# Altium schematic sheet LAN8870_PINOUT.SchDoc
size C; SheetNumber: 3; SheetTotal: 5
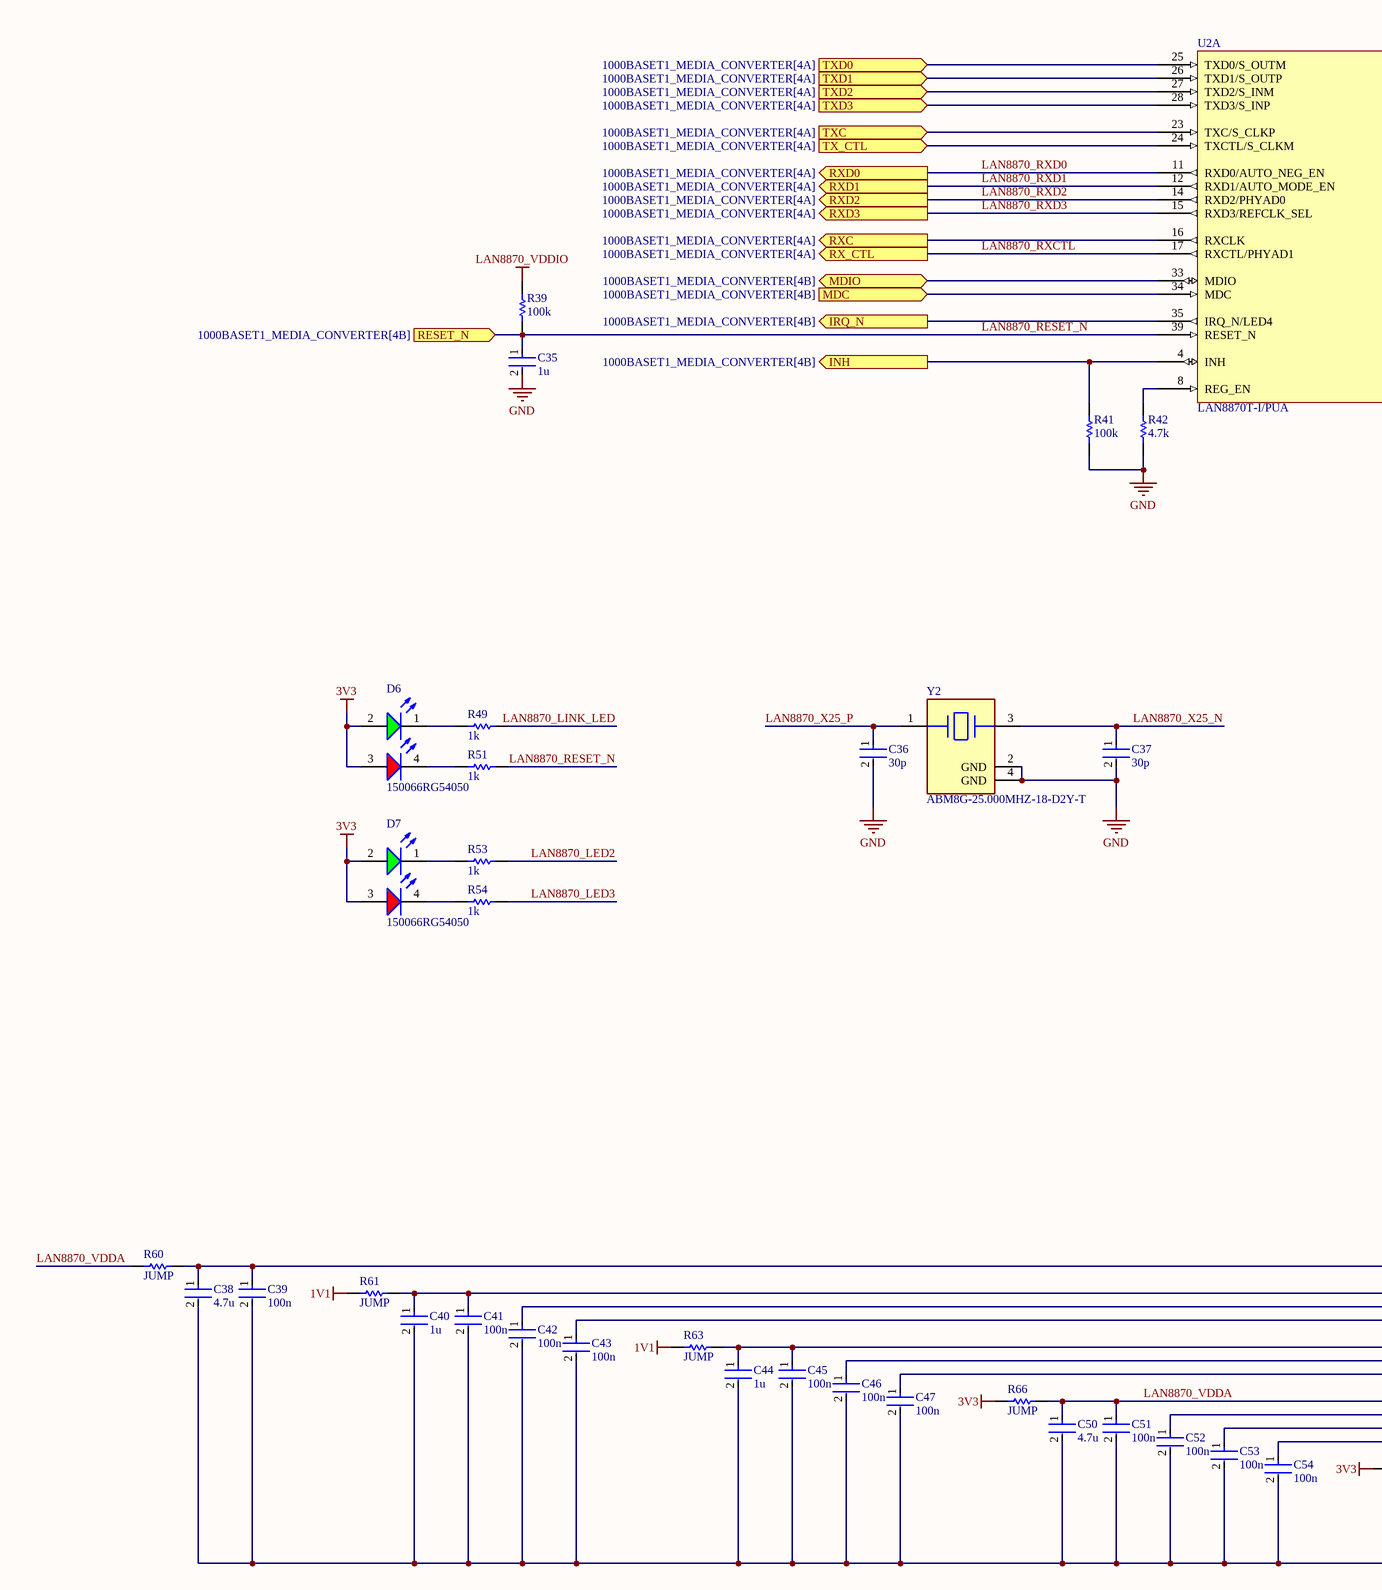
[diagram p0: LAN8870_PINOUT.SchDoc, left]
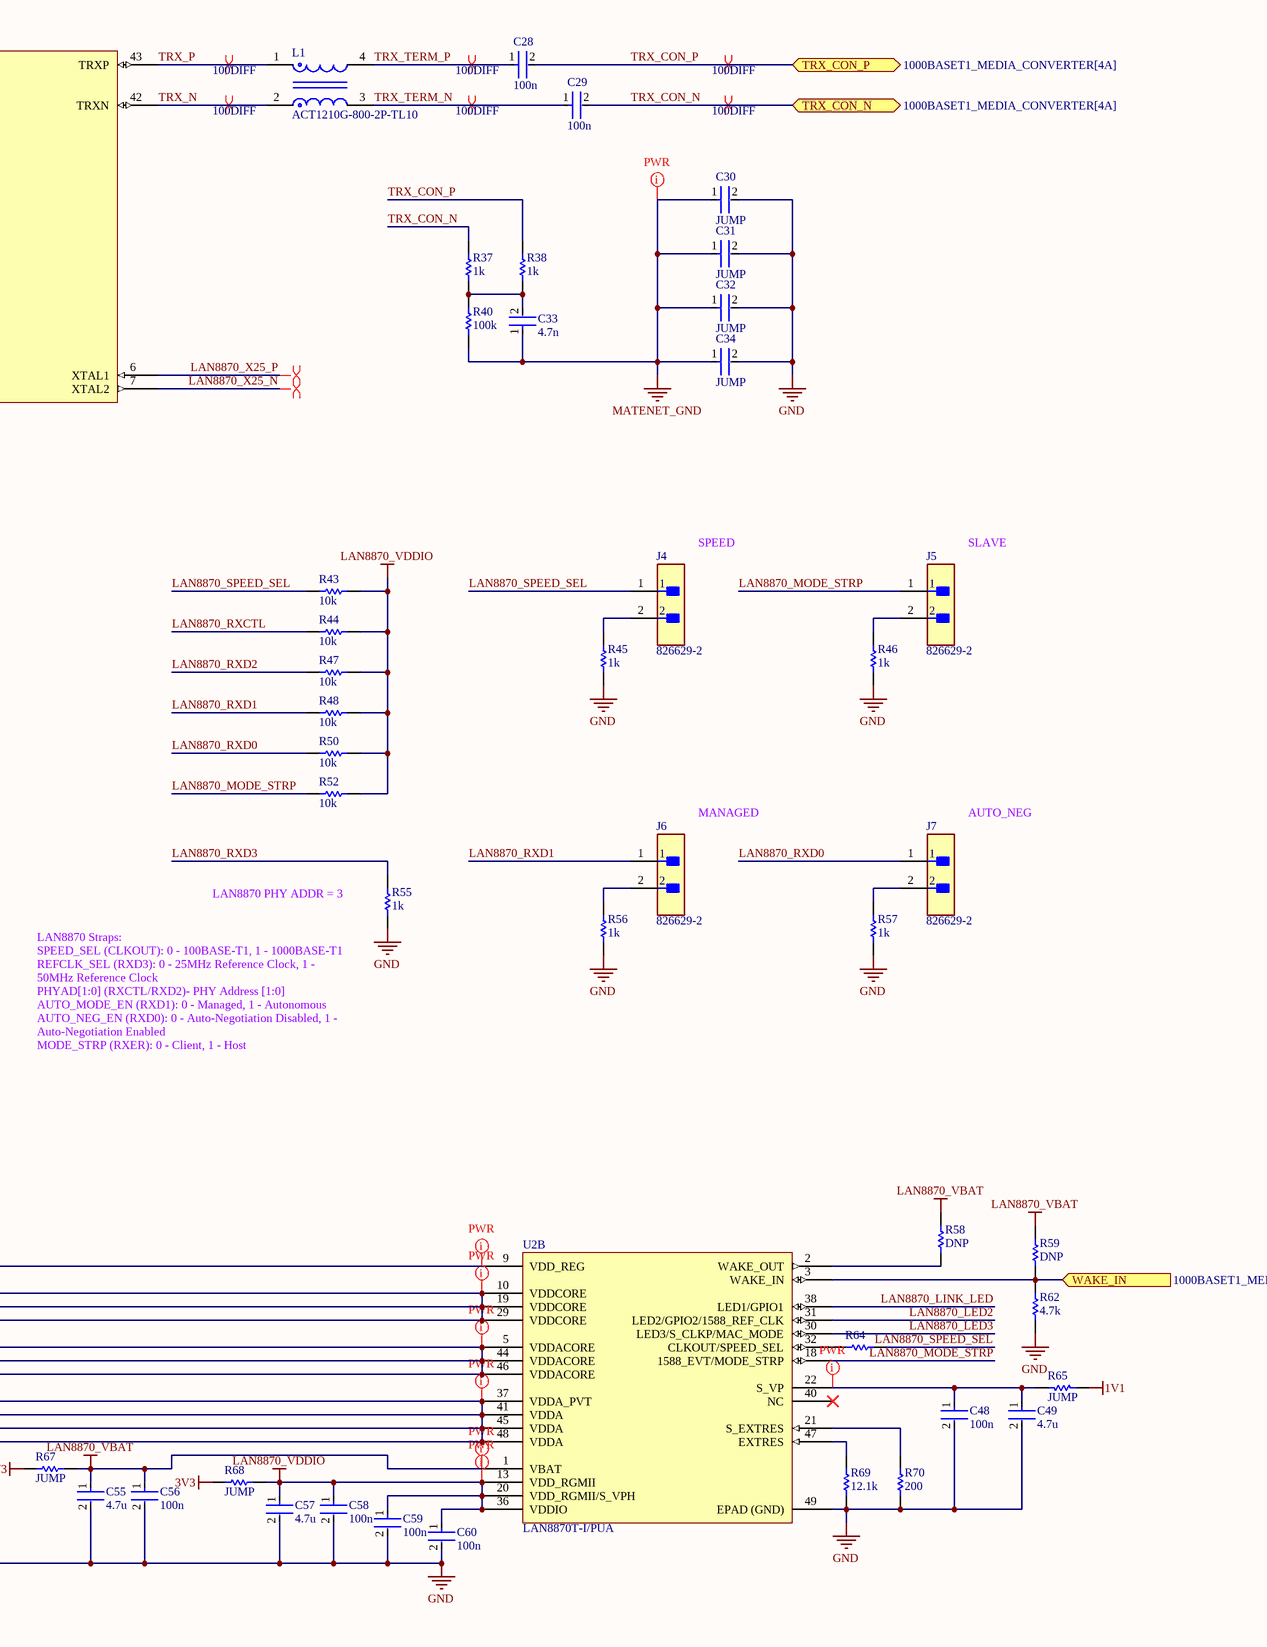
[diagram p1: LAN8870_PINOUT.SchDoc, right]

## Parts
C28  100n  [FP-0402-L_1_0_0_05-W_0_5-IPC_A]
C29  100n  [FP-0402-L_1_0_0_05-W_0_5-IPC_A]
C30  JUMP  [FP-0402-L_1_0_0_05-W_0_5-IPC_A]
C31  JUMP  [FP-0402-L_1_0_0_05-W_0_5-IPC_A]
C32  JUMP  [FP-0402-L_1_0_0_05-W_0_5-IPC_A]
C33  4.7n  [FP-0402-L_1_0_0_05-W_0_5-IPC_A]
C34  JUMP  [FP-0402-L_1_0_0_05-W_0_5-IPC_A]
C35  1u  [FP-0402-L_1_0_0_05-W_0_5-IPC_A]
C36  30p  [FP-0402-L_1_0_0_05-W_0_5-IPC_A]
C37  30p  [FP-0402-L_1_0_0_05-W_0_5-IPC_A]
C38  4.7u  [FP-0402-L_1_0_0_05-W_0_5-IPC_A]
C39  100n  [FP-0402-L_1_0_0_05-W_0_5-IPC_A]
C40  1u  [FP-0402-L_1_0_0_05-W_0_5-IPC_A]
C41  100n  [FP-0402-L_1_0_0_05-W_0_5-IPC_A]
C42  100n  [FP-0402-L_1_0_0_05-W_0_5-IPC_A]
C43  100n  [FP-0402-L_1_0_0_05-W_0_5-IPC_A]
C44  1u  [FP-0402-L_1_0_0_05-W_0_5-IPC_A]
C45  100n  [FP-0402-L_1_0_0_05-W_0_5-IPC_A]
C46  100n  [FP-0402-L_1_0_0_05-W_0_5-IPC_A]
C47  100n  [FP-0402-L_1_0_0_05-W_0_5-IPC_A]
C48  100n  [FP-0402-L_1_0_0_05-W_0_5-IPC_A]
C49  4.7u  [FP-0402-L_1_0_0_05-W_0_5-IPC_A]
C50  4.7u  [FP-0402-L_1_0_0_05-W_0_5-IPC_A]
C51  100n  [FP-0402-L_1_0_0_05-W_0_5-IPC_A]
C52  100n  [FP-0402-L_1_0_0_05-W_0_5-IPC_A]
C53  100n  [FP-0402-L_1_0_0_05-W_0_5-IPC_A]
C54  100n  [FP-0402-L_1_0_0_05-W_0_5-IPC_A]
C55  4.7u  [FP-0402-L_1_0_0_05-W_0_5-IPC_A]
C56  100n  [FP-0402-L_1_0_0_05-W_0_5-IPC_A]
C57  4.7u  [FP-0402-L_1_0_0_05-W_0_5-IPC_A]
C58  100n  [FP-0402-L_1_0_0_05-W_0_5-IPC_A]
C59  100n  [FP-0402-L_1_0_0_05-W_0_5-IPC_A]
C60  100n  [FP-0402-L_1_0_0_05-W_0_5-IPC_A]
D6  150066RG54050  [WL-SBCD_0606]
D7  150066RG54050  [WL-SBCD_0606]
J4  826629-2  [FP-826629-2-MFG]
J5  826629-2  [FP-826629-2-MFG]
J6  826629-2  [FP-826629-2-MFG]
J7  826629-2  [FP-826629-2-MFG]
L1  ACT1210G-800-2P-TL10  [FP-ACT1210G-800-2P-TL10-MFG]
R37  1k  [R0603B]
R38  1k  [R0603B]
R39  100k  [R0603B]
R40  100k  [R0603B]
R41  100k  [R0603B]
R42  4.7k  [R0603B]
R43  10k  [R0603B]
R44  10k  [R0603B]
R45  1k  [R0603B]
R46  1k  [R0603B]
R47  10k  [R0603B]
R48  10k  [R0603B]
R49  1k  [R0603B]
R50  10k  [R0603B]
R51  1k  [R0603B]
R52  10k  [R0603B]
R53  1k  [R0603B]
R54  1k  [R0603B]
R55  1k  [R0603B]
R56  1k  [R0603B]
R57  1k  [R0603B]
R58  DNP  [R0603B]
R59  DNP  [R0603B]
R60  JUMP  [R0603B]
R61  JUMP  [R0603B]
R62  4.7k  [R0603B]
R63  JUMP  [R0603B]
R64  0402 JUMPER  [RESC1005X40X25ML05T05]  (value not drawn)
R65  JUMP  [R0603B]
R66  JUMP  [R0603B]
R67  JUMP  [R0603B]
R68  JUMP  [R0603B]
R69  12.1k  [R0603B]
R70  200  [R0603B]
U2  LAN8870T-I/PUA  [QFN50P700X700X100_HS-49N]  (parts A,B of 2)
Y2  ABM8G-25.000MHZ-18-D2Y-T  [FP-ABM8G-MFG]

## Ports
INH (out, see 1000BASET1_MEDIA_CONVERTER[4B]), IRQ_N (out, see 1000BASET1_MEDIA_CONVERTER[4B]), MDC (in, see 1000BASET1_MEDIA_CONVERTER[4B]), MDIO (bidir, see 1000BASET1_MEDIA_CONVERTER[4B]), RESET_N (in, see 1000BASET1_MEDIA_CONVERTER[4B]), RX_CTL (out, see 1000BASET1_MEDIA_CONVERTER[4A]), RXC (out, see 1000BASET1_MEDIA_CONVERTER[4A]), RXD0 (out, see 1000BASET1_MEDIA_CONVERTER[4A]), RXD1 (out, see 1000BASET1_MEDIA_CONVERTER[4A]), RXD2 (out, see 1000BASET1_MEDIA_CONVERTER[4A]), RXD3 (out, see 1000BASET1_MEDIA_CONVERTER[4A]), TRX_CON_N (bidir, see 1000BASET1_MEDIA_CONVERTER[4A]), TRX_CON_P (bidir, see 1000BASET1_MEDIA_CONVERTER[4A]), TX_CTL (in, see 1000BASET1_MEDIA_CONVERTER[4A]), TXC (in, see 1000BASET1_MEDIA_CONVERTER[4A]), TXD0 (in, see 1000BASET1_MEDIA_CONVERTER[4A]), TXD1 (in, see 1000BASET1_MEDIA_CONVERTER[4A]), TXD2 (in, see 1000BASET1_MEDIA_CONVERTER[4A]), TXD3 (in, see 1000BASET1_MEDIA_CONVERTER[4A]), WAKE_IN (in, see 1000BASET1_MEDIA_CONVERTER[4B])

## Nets
1V1: R61.1 R63.1 R65.1
3V3: D6.2(A) D6.3(A) D7.2(A) D7.3(A) R66.1 R67.1 R68.1
GND: C30.2 C31.2 C32.2 C34.2 C35.2 C36.2 C37.2 C38.2 C39.2 C40.2 C41.2 C42.2 C43.2 C44.2 C45.2 C46.2 C47.2 C48.2 C49.2 C50.2 C51.2 C52.2 C53.2 C54.2 C55.2 C56.2 C57.2 C58.2 C59.2 C60.2 R41.2 R42.2 R45.1 R46.1 R55.1 R56.1 R57.1 R62.2 R69.2 R70.2 U2.49(EPAD_(GND)) Y2.2(GND) Y2.4(GND)
LAN8870_VBAT: C55.1 C56.1 R58.1 R59.1 R67.2 U2.1(VBAT)
LAN8870_VDDIO: C57.1 C58.1 C59.1 C60.1 R39.1 R43.2 R44.1 R47.2 R48.2 R50.2 R52.2 R68.2 U2.13(VDD_RGMII) U2.20(VDD_RGMII/S_VPH) U2.36(VDDIO)
MATENET_GND: C30.1 C31.1 C32.1 C33.1 C34.1 R40.2
INH: R41.1 U2.4(INH) ; port INH
IRQ_N: U2.35(IRQ_N/LED4) ; port IRQ_N
LAN8870_LED2: R53.2 U2.31(LED2/GPIO2/1588_REF_CLK)
LAN8870_LED3: R54.2 U2.30(LED3/S_CLKP/MAC_MODE)
LAN8870_LINK_LED: R49.2 U2.38(LED1/GPIO1)
LAN8870_MODE_STRP: J5.1 R52.1 U2.18(1588_EVT/MODE_STRP)
LAN8870_RESET_N: C35.1 R39.2 R51.2 U2.39(RESET_N) ; port RESET_N
LAN8870_RXCTL: R44.2 U2.17(RXCTL/PHYAD1) ; port RX_CTL
LAN8870_RXD0: J7.1 R50.1 U2.11(RXD0/AUTO_NEG_EN) ; port RXD0
LAN8870_RXD1: J6.1 R48.1 U2.12(RXD1/AUTO_MODE_EN) ; port RXD1
LAN8870_RXD2: R47.1 U2.14(RXD2/PHYAD0) ; port RXD2
LAN8870_RXD3: R55.2 U2.15(RXD3/REFCLK_SEL) ; port RXD3
LAN8870_SPEED_SEL: J4.1 R43.1 R64.2
LAN8870_VDDA: C50.1 C51.1 C52.1 C53.1 C54.1 R60.1 R66.2 U2.37(VDDA_PVT) U2.41(VDDA) U2.45(VDDA) U2.48(VDDA)
LAN8870_X25_N: C37.1 U2.7(XTAL2) Y2.3
LAN8870_X25_P: C36.1 U2.6(XTAL1) Y2.1
MDC: U2.34(MDC) ; port MDC
MDIO: U2.33(MDIO) ; port MDIO
RXC: U2.16(RXCLK) ; port RXC
TRX_CON_N: C29.2 R37.2 ; port TRX_CON_N
TRX_CON_P: C28.2 R38.2 ; port TRX_CON_P
TRX_N: L1.2 U2.42(TRXN)
TRX_P: L1.1 U2.43(TRXP)
TRX_TERM_N: C29.1 L1.3
TRX_TERM_P: C28.1 L1.4
TX_CTL: U2.24(TXCTL/S_CLKM) ; port TX_CTL
TXC: U2.23(TXC/S_CLKP) ; port TXC
TXD0: U2.25(TXD0/S_OUTM) ; port TXD0
TXD1: U2.26(TXD1/S_OUTP) ; port TXD1
TXD2: U2.27(TXD2/S_INM) ; port TXD2
TXD3: U2.28(TXD3/S_INP) ; port TXD3
WAKE_IN: R59.2 R62.1 U2.3(WAKE_IN) ; port WAKE_IN
NetC33_2: C33.2 R37.1 R38.1 R40.1
NetC38_1: C38.1 C39.1 R60.2 U2.9(VDD_REG)
NetC40_1: C40.1 C41.1 C42.1 C43.1 R61.2 U2.10(VDDCORE) U2.19(VDDCORE) U2.29(VDDCORE)
NetC44_1: C44.1 C45.1 C46.1 C47.1 R63.2 U2.5(VDDACORE) U2.44(VDDACORE) U2.46(VDDACORE)
NetC48_1: C48.1 C49.1 R65.2 U2.22(S_VP)
NetD6_1: D6.1(K) R49.1
NetD6_4: D6.4(K) R51.1
NetD7_1: D7.1(K) R53.1
NetD7_4: D7.4(K) R54.1
NetJ4_2: J4.2 R45.2
NetJ5_2: J5.2 R46.2
NetJ6_2: J6.2 R56.2
NetJ7_2: J7.2 R57.2
NetR42_1: R42.1 U2.8(REG_EN)
NetR58_2: R58.2 U2.2(WAKE_OUT)
NetR64_1: R64.1 U2.32(CLKOUT/SPEED_SEL)
NetR69_1: R69.1 U2.47(EXTRES)
NetR70_1: R70.1 U2.21(S_EXTRES)

Not connected (* = marked no-connect by the designer): U2 40(NC)*

## Layout directives
differential pair; differential pair class 100DIFF: TRX_CON_N, TRX_CON_P, TRX_N, TRX_P, TRX_TERM_N, TRX_TERM_P
differential pair: LAN8870_X25_N, LAN8870_X25_P
net class PWR: LAN8870_VBAT, LAN8870_VDDA, LAN8870_VDDIO, MATENET_GND, NetC38_1, NetC40_1, NetC44_1, NetC48_1

## Notes on the sheet
- SPEED
- SLAVE
- MANAGED
- AUTO_NEG
- LAN8870 PHY ADDR = 3
- (near R55) LAN8870 Straps:
  SPEED_SEL (CLKOUT): 0 - 100BASE-T1, 1 - 1000BASE-T1
  REFCLK_SEL (RXD3): 0 - 25MHz Reference Clock, 1 - 50MHz Reference Clock
  PHYAD[1:0] (RXCTL/RXD2)- PHY Address [1:0]
  AUTO_MODE_EN (RXD1): 0 - Managed, 1 - Autonomous
  AUTO_NEG_EN (RXD0): 0 - Auto-Negotiation Disabled, 1 - Auto-Negotiation Enabled
  MODE_STRP (RXER): 0 - Client, 1 - Host

## Library data of the parts
C28-C60 = CMP-001-00058-1: LARGE PADS, 0402 CAP, CHANGE COMMENT TO MATCH REAL P/N; Capacitor Type: Ceramic; Min Operating Temperature: -55°C; Mounting Technology: Surface Mount; Pins: 2; Case/Package: 0402; RoHS Compliant: Yes; Max Operating Temperature: 85°C
D6 D7 = CMP-004-00040-2: Led, Red/Grn, 180Mcd/230Mcd, 624Nm/525Nm Rohs Compliant: Yes; Source: rgled.SchLib; Component Type: Standard; Design Item ID: CMP-004-00034-2; Pins: 4
J4-J7 = CMP-05178-000003-1: CONN HEADER VERT 2POS 2.54MM; RoHS Compliant: Yes
L1 = CMP-08256-000023-1: CMC 80UH 70MA 2LN 3.8KOHM SMD
R37 R38 R42-R59 R62 R69 R70 = CMP-009-00002-14: Resistor; Value: 100k
R39-R41 = CMP-009-00002-14: Resistor; Value: 100k
R60 R61 R63 R65-R68 = CMP-009-00002-14: Resistor; Value: 0
R64 = CMP-009-00118-2: READ THE NAME; Pins: 2; Component Type: Standard; Design Item ID: CMP-009-00206-2; Source: 0402jump.SchLib
U2 = CMP-015-00023-4: 100/1000BASE-T1 Rgmii/sgmii Phy; Case/Package: VQFN; Pins: 48
Y2 = CMP-2000-05733-3: Crystal 25MHz ±20ppm (Tol) ±30ppm (Stability) 18pF FUND 60Ω 4-Pin SMD T/R; Series Resistance: 60R; Length: 3.2mm; Depth: 2.5mm; Packaging: Tape and Reel; Min Operating Temperature: -40°C; Operating Frequency: 25 MHz; Lead Free: Lead Free; Number of Pins: 4; Frequency Tolerance: 20ppm; Radiation Hardening: No; Max Operating Temperature: 85°C; Termination: SMD/SMT; Frequency Stability: 30ppm; Frequency: 25MHz; Series: ABM8G; Mount: Surface Mount; Package Quantity: 1000; Height: 0.039inch; Width: 0.098inch; Case/Package: CSMD; ESR (Equivalent Series Resistance): 60R; Load Capacitance: 18pF; Tolerance: 20ppm